# Altium schematic sheet fpga-ground-outside.SchDoc: FPGA - Ground
size Letter; CheckedBy: E. Chiu; CompanyName: Brinton Engineering, LLC; DrawnBy: J. Brinton; Engineer: J. Brinton; Address1: 3479 Edison Way; Address2: Menlo Park CA 94025; Address3: +1 (877) 778-8435; Address4: brintonengineering.com; Revision: 1; SheetNumber: 18; SheetTotal: 48
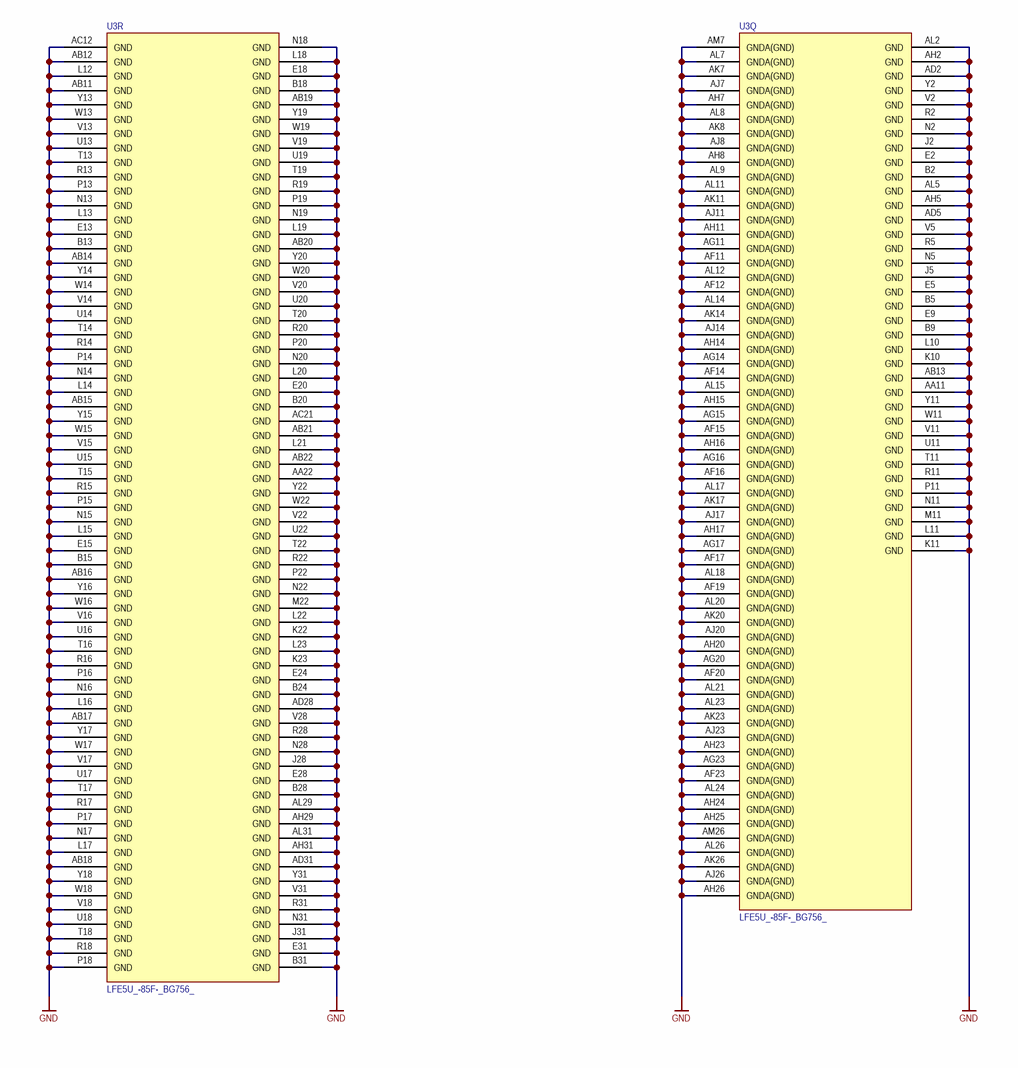
[diagram p0: fpga-ground-outside.SchDoc]

## Parts
U3  LFE5U_-85F-_BG756_  [caBGA756]  (parts Q,R of 19)

## Nets
GND: U3.AA11(GND) U3.AA22(GND) U3.AB11(GND) U3.AB12(GND) U3.AB13(GND) U3.AB14(GND) U3.AB15(GND) U3.AB16(GND) U3.AB17(GND) U3.AB18(GND) U3.AB19(GND) U3.AB20(GND) U3.AB21(GND) U3.AB22(GND) U3.AC12(GND) U3.AC21(GND) U3.AD2(GND) U3.AD5(GND) U3.AD28(GND) U3.AD31(GND) U3.AF11(GNDA(GND)) U3.AF12(GNDA(GND)) U3.AF14(GNDA(GND)) U3.AF15(GNDA(GND)) U3.AF16(GNDA(GND)) U3.AF17(GNDA(GND)) U3.AF19(GNDA(GND)) U3.AF20(GNDA(GND)) U3.AF23(GNDA(GND)) U3.AG11(GNDA(GND)) U3.AG14(GNDA(GND)) U3.AG15(GNDA(GND)) U3.AG16(GNDA(GND)) U3.AG17(GNDA(GND)) U3.AG20(GNDA(GND)) U3.AG23(GNDA(GND)) U3.AH2(GND) U3.AH5(GND) U3.AH7(GNDA(GND)) U3.AH8(GNDA(GND)) U3.AH11(GNDA(GND)) U3.AH14(GNDA(GND)) U3.AH15(GNDA(GND)) U3.AH16(GNDA(GND)) U3.AH17(GNDA(GND)) U3.AH20(GNDA(GND)) U3.AH23(GNDA(GND)) U3.AH24(GNDA(GND)) U3.AH25(GNDA(GND)) U3.AH26(GNDA(GND)) U3.AH29(GND) U3.AH31(GND) U3.AJ7(GNDA(GND)) U3.AJ8(GNDA(GND)) U3.AJ11(GNDA(GND)) U3.AJ14(GNDA(GND)) U3.AJ17(GNDA(GND)) U3.AJ20(GNDA(GND)) U3.AJ23(GNDA(GND)) U3.AJ26(GNDA(GND)) U3.AK7(GNDA(GND)) U3.AK8(GNDA(GND)) U3.AK11(GNDA(GND)) U3.AK14(GNDA(GND)) U3.AK17(GNDA(GND)) U3.AK20(GNDA(GND)) U3.AK23(GNDA(GND)) U3.AK26(GNDA(GND)) U3.AL2(GND) U3.AL5(GND) U3.AL7(GNDA(GND)) U3.AL8(GNDA(GND)) U3.AL9(GNDA(GND)) U3.AL11(GNDA(GND)) U3.AL12(GNDA(GND)) U3.AL14(GNDA(GND)) U3.AL15(GNDA(GND)) U3.AL17(GNDA(GND)) U3.AL18(GNDA(GND)) U3.AL20(GNDA(GND)) U3.AL21(GNDA(GND)) U3.AL23(GNDA(GND)) U3.AL24(GNDA(GND)) U3.AL26(GNDA(GND)) U3.AL29(GND) U3.AL31(GND) U3.AM7(GNDA(GND)) U3.AM26(GNDA(GND)) U3.B2(GND) U3.B5(GND) U3.B9(GND) U3.B13(GND) U3.B15(GND) U3.B18(GND) U3.B20(GND) U3.B24(GND) U3.B28(GND) U3.B31(GND) U3.E2(GND) U3.E5(GND) U3.E9(GND) U3.E13(GND) U3.E15(GND) U3.E18(GND) U3.E20(GND) U3.E24(GND) U3.E28(GND) U3.E31(GND) U3.J2(GND) U3.J5(GND) U3.J28(GND) U3.J31(GND) U3.K10(GND) U3.K11(GND) U3.K22(GND) U3.K23(GND) U3.L10(GND) U3.L11(GND) U3.L12(GND) U3.L13(GND) U3.L14(GND) U3.L15(GND) U3.L16(GND) U3.L17(GND) U3.L18(GND) U3.L19(GND) U3.L20(GND) U3.L21(GND) U3.L22(GND) U3.L23(GND) U3.M11(GND) U3.M22(GND) U3.N2(GND) U3.N5(GND) U3.N11(GND) U3.N13(GND) U3.N14(GND) U3.N15(GND) U3.N16(GND) U3.N17(GND) U3.N18(GND) U3.N19(GND) U3.N20(GND) U3.N22(GND) U3.N28(GND) U3.N31(GND) U3.P11(GND) U3.P13(GND) U3.P14(GND) U3.P15(GND) U3.P16(GND) U3.P17(GND) U3.P18(GND) U3.P19(GND) U3.P20(GND) U3.P22(GND) U3.R2(GND) U3.R5(GND) U3.R11(GND) U3.R13(GND) U3.R14(GND) U3.R15(GND) U3.R16(GND) U3.R17(GND) U3.R18(GND) U3.R19(GND) U3.R20(GND) U3.R22(GND) U3.R28(GND) U3.R31(GND) U3.T11(GND) U3.T13(GND) U3.T14(GND) U3.T15(GND) U3.T16(GND) U3.T17(GND) U3.T18(GND) U3.T19(GND) U3.T20(GND) U3.T22(GND) U3.U11(GND) U3.U13(GND) U3.U14(GND) U3.U15(GND) U3.U16(GND) U3.U17(GND) U3.U18(GND) U3.U19(GND) U3.U20(GND) U3.U22(GND) U3.V2(GND) U3.V5(GND) U3.V11(GND) U3.V13(GND) U3.V14(GND) U3.V15(GND) U3.V16(GND) U3.V17(GND) U3.V18(GND) U3.V19(GND) U3.V20(GND) U3.V22(GND) U3.V28(GND) U3.V31(GND) U3.W11(GND) U3.W13(GND) U3.W14(GND) U3.W15(GND) U3.W16(GND) U3.W17(GND) U3.W18(GND) U3.W19(GND) U3.W20(GND) U3.W22(GND) U3.Y2(GND) U3.Y11(GND) U3.Y13(GND) U3.Y14(GND) U3.Y15(GND) U3.Y16(GND) U3.Y17(GND) U3.Y18(GND) U3.Y19(GND) U3.Y20(GND) U3.Y22(GND) U3.Y31(GND)

## Notes on the sheet
- Title
- Engineer
- Revision
- Drawn By
- Checked By
- Date
- Sheet
- of

## Library data of the parts
U3 = LFE5U_-85F-_BG756_: ECP5 FPGA, 85k LUT, 756-caBGA; Manufacturer: Lattice Semiconductor; Manufacturer P/N: LFE5U_-85F-_BG756_